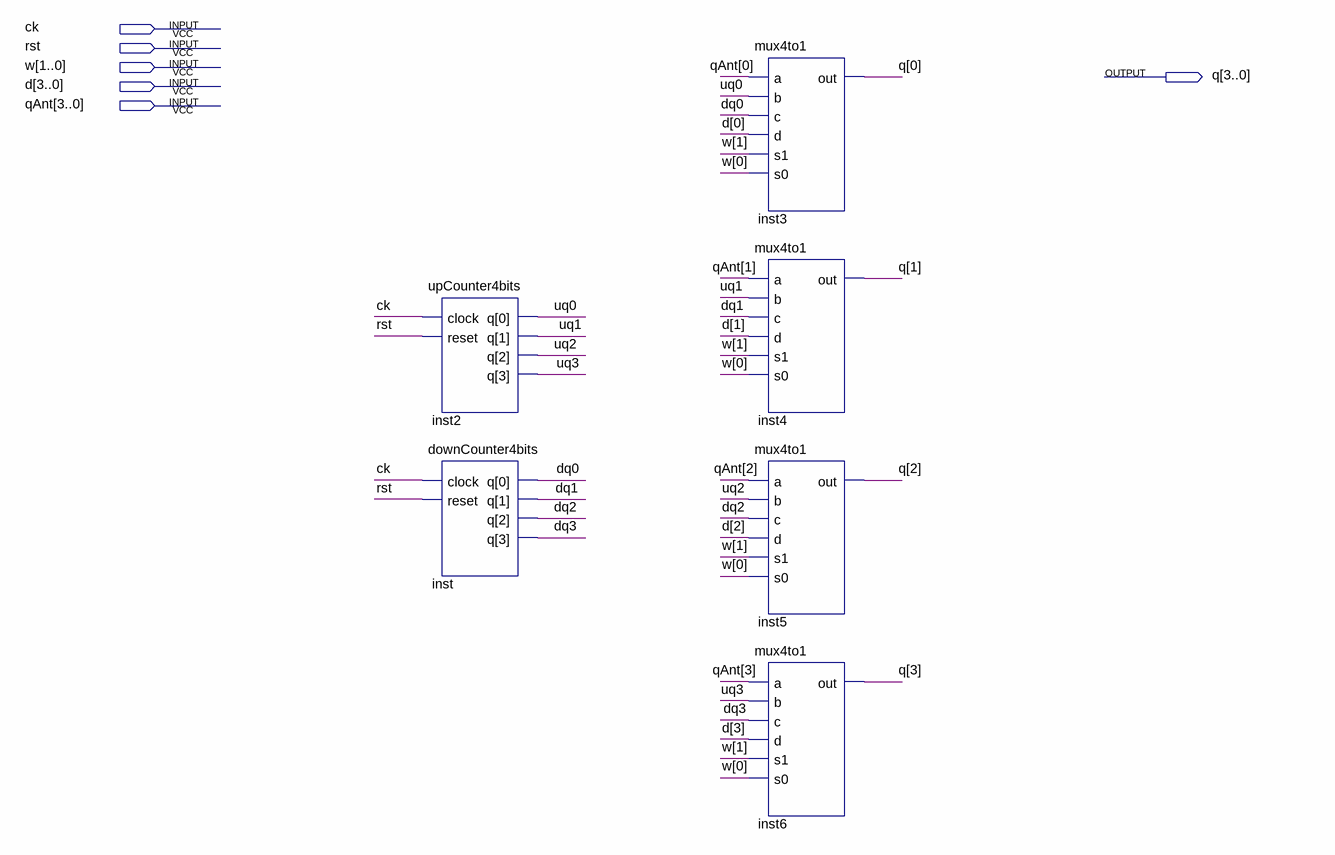
[diagram p0: schematic sheet]
// Quartus schematic contador4bits.bdf as structural Verilog: 6 symbols, 6 pins
module contador4bits (
  input  ck,
  input  rst,
  input  [1:0] w,
  input  [3:0] d,
  input  [3:0] qAnt,
  output [3:0] q
);

  wire dq0, dq1, dq2, dq3, uq0, uq1, uq2, uq3;

  upCounter4bits inst2 (.clock(ck), .reset(rst), .q({uq3, uq2, uq1, uq0}));
  downCounter4bits inst (.clock(ck), .reset(rst), .q({dq3, dq2, dq1, dq0}));
  mux4to1 inst3 (.a(qAnt[0]), .b(uq0), .c(dq0), .d(d[0]), .s1(w[1]), .s0(w[0]), .out(q[0]));
  mux4to1 inst4 (.a(qAnt[1]), .b(uq1), .c(dq1), .d(d[1]), .s1(w[1]), .s0(w[0]), .out(q[1]));
  mux4to1 inst5 (.a(qAnt[2]), .b(uq2), .c(dq2), .d(d[2]), .s1(w[1]), .s0(w[0]), .out(q[2]));
  mux4to1 inst6 (.a(qAnt[3]), .b(uq3), .c(dq3), .d(d[3]), .s1(w[1]), .s0(w[0]), .out(q[3]));
endmodule
